# Altium schematic sheet [2]-PHY.SchDoc
size A3; SheetNumber: 2; SheetTotal: 2
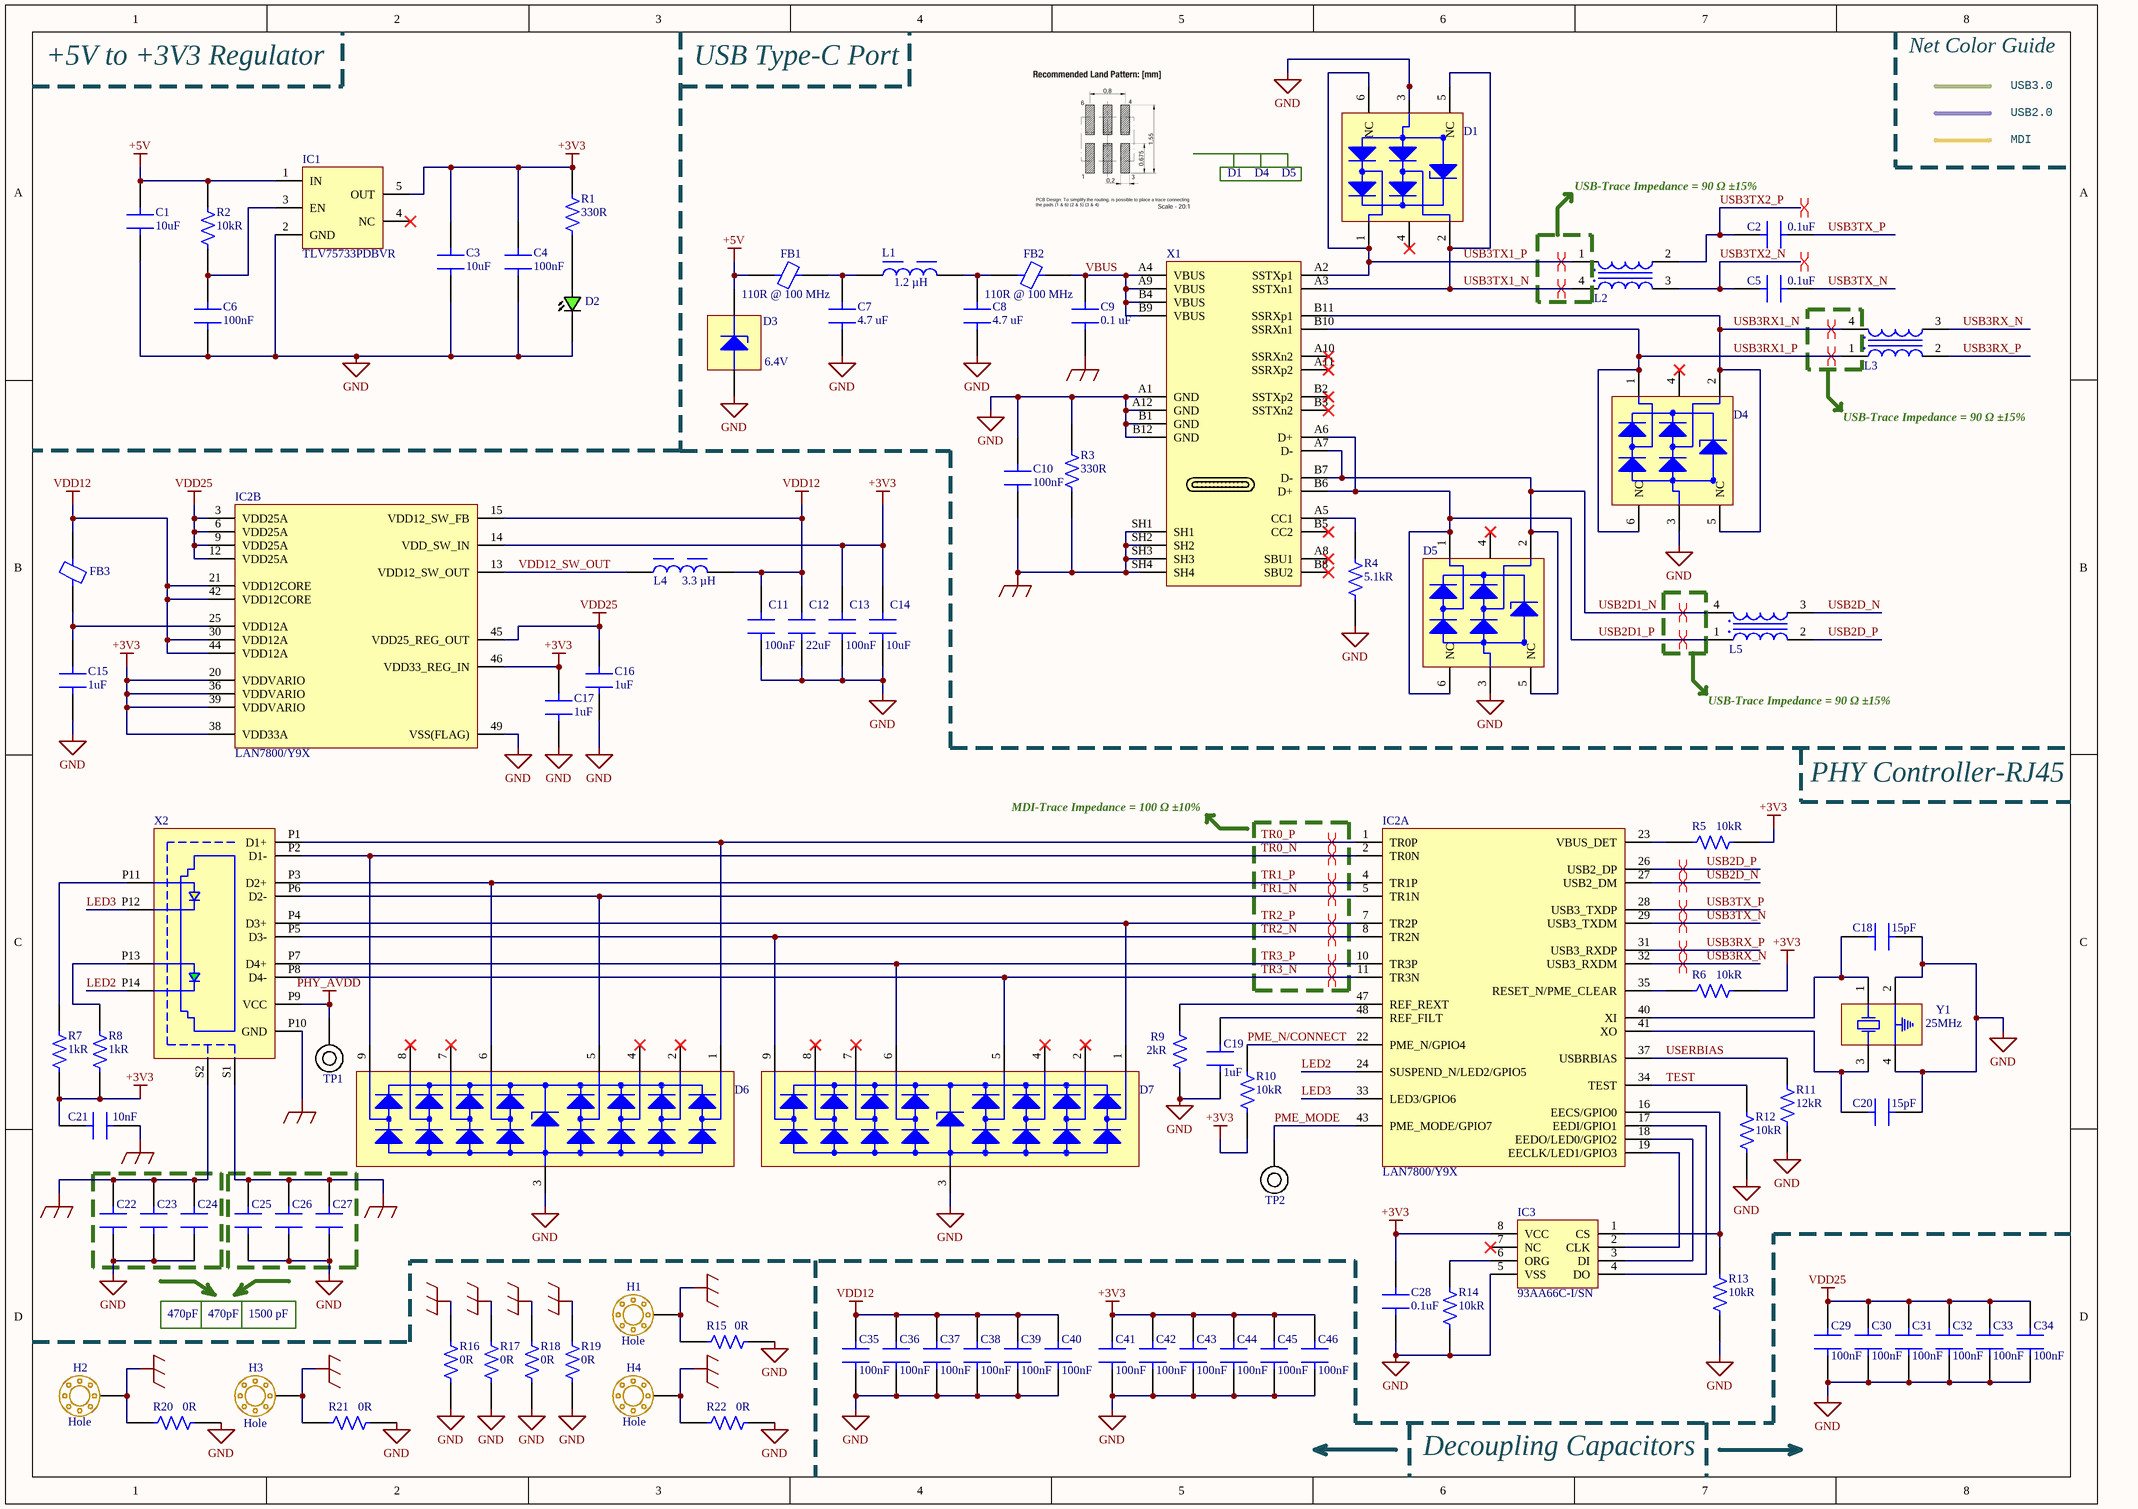
[diagram p0: [2]-PHY.SchDoc]

## Parts
C1  Capacitance: 10uF  [CAP CER 0603 MURATA]  (hidden comment: GRM188R61A106ME69D)
C2  Capacitance: 0.1uF  [CAP CER 0402 (1005 Metric)]  (hidden comment: 885012105018)
C3  Capacitance: 10uF  [CAP CER 0603 MURATA]  (hidden comment: GRM188R61A106ME69D)
C4  Capacitance: 100nF  [CAP CER 0603 (1608 Metric)]  (hidden comment: 885012206071)
C5  Capacitance: 0.1uF  [CAP CER 0402 (1005 Metric)]  (hidden comment: 885012105018)
C6  Capacitance: 100nF  [CAP CER 0603 (1608 Metric)]  (hidden comment: 885012206071)
C7  Capacitance: 4.7 uF  [CAP CER 0805 (2012 Metric)]  (hidden comment: 885012107018)
C8  Capacitance: 4.7 uF  [CAP CER 0805 (2012 Metric)]  (hidden comment: 885012107018)
C9  Capacitance: 0.1 uF  [CAP CER 0805 (2012 Metric)]  (hidden comment: 885012207098)
C10  Capacitance: 100nF  [CAP CER 0603 (1608 Metric)]  (hidden comment: 885012206071)
C11  Capacitance: 100nF  [CAP CER 0603 (1608 Metric)]  (hidden comment: 885012206071)
C12  Capacitance: 22uF  [CAP CER 0805 (2012 Metric)]  (hidden comment: 885012107005)
C13  Capacitance: 100nF  [CAP CER 0603 (1608 Metric)]  (hidden comment: 885012206071)
C14  Capacitance: 10uF  [CAP CER 0603 MURATA]  (hidden comment: GRM188R61A106ME69D)
C15  Capacitance: 1uF  [CAP CER 0603 (1608 Metric)]  (hidden comment: 885012206052)
C16  Capacitance: 1uF  [CAP CER 0603 (1608 Metric)]  (hidden comment: 885012206052)
C17  Capacitance: 1uF  [CAP CER 0603 (1608 Metric)]  (hidden comment: 885012206052)
C18  Capacitance: 15pF  [CAP CER 0402 (1005 Metric)]  (hidden comment: 885012005056)
C19  Capacitance: 1uF  [CAP CER 0603 (1608 Metric)]  (hidden comment: 885012206052)
C20  Capacitance: 15pF  [CAP CER 0402 (1005 Metric)]  (hidden comment: 885012005056)
C21  Capacitance: 10nF  [CAP CER 0603 (1608 Metric)]  (hidden comment: 885012206065)
C22  Capacitance: 470pF  [CAP CER 1206 (3216 Metric)]  (hidden comment: 885342208023)
C23  Capacitance: 470pF  [CAP CER 1206 (3216 Metric)]  (hidden comment: 885342208023)
C24  Capacitance: 1500 pF  [CAP CER 1825 (4564 Metric)]  (hidden comment: HV1825Y152KXMATHV)
C25  885342208023  [CAP CER 1206 (3216 Metric)]  (value not drawn)
C26  885342208023  [CAP CER 1206 (3216 Metric)]  (value not drawn)
C27  HV1825Y152KXMATHV  [CAP CER 1825 (4564 Metric)]  (value not drawn)
C28  Capacitance: 0.1uF  [CAP CER 0603 (1608 Metric)]  (hidden comment: 885012206071)
C29  Capacitance: 100nF  [CAP CER 0603 (1608 Metric)]  (hidden comment: 885012206071)
C30  Capacitance: 100nF  [CAP CER 0603 (1608 Metric)]  (hidden comment: 885012206071)
C31  Capacitance: 100nF  [CAP CER 0603 (1608 Metric)]  (hidden comment: 885012206071)
C32  Capacitance: 100nF  [CAP CER 0603 (1608 Metric)]  (hidden comment: 885012206071)
C33  Capacitance: 100nF  [CAP CER 0603 (1608 Metric)]  (hidden comment: 885012206071)
C34  Capacitance: 100nF  [CAP CER 0603 (1608 Metric)]  (hidden comment: 885012206071)
C35  Capacitance: 100nF  [CAP CER 0603 (1608 Metric)]  (hidden comment: 885012206071)
C36  Capacitance: 100nF  [CAP CER 0603 (1608 Metric)]  (hidden comment: 885012206071)
C37  Capacitance: 100nF  [CAP CER 0603 (1608 Metric)]  (hidden comment: 885012206071)
C38  Capacitance: 100nF  [CAP CER 0603 (1608 Metric)]  (hidden comment: 885012206071)
C39  Capacitance: 100nF  [CAP CER 0603 (1608 Metric)]  (hidden comment: 885012206071)
C40  Capacitance: 100nF  [CAP CER 0603 (1608 Metric)]  (hidden comment: 885012206071)
C41  Capacitance: 100nF  [CAP CER 0603 (1608 Metric)]  (hidden comment: 885012206071)
C42  Capacitance: 100nF  [CAP CER 0603 (1608 Metric)]  (hidden comment: 885012206071)
C43  Capacitance: 100nF  [CAP CER 0603 (1608 Metric)]  (hidden comment: 885012206071)
C44  Capacitance: 100nF  [CAP CER 0603 (1608 Metric)]  (hidden comment: 885012206071)
C45  Capacitance: 100nF  [CAP CER 0603 (1608 Metric)]  (hidden comment: 885012206071)
C46  Capacitance: 100nF  [CAP CER 0603 (1608 Metric)]  (hidden comment: 885012206071)
D1  824012823  [6-XFDFN]  (value not drawn)
D2  150060VS75020  [LED GREEN 0603]  (value not drawn)
D3  Voltage - Breakdown (Min): 6.4V  [2-UDFN]  (hidden comment: ESDA7P60-1U1M)
D4  824012823  [6-XFDFN]  (value not drawn)
D5  824012823  [6-XFDFN]  (value not drawn)
D6  824014885  [DFN3810-9]  (value not drawn)
D7  824014885  [DFN3810-9]  (value not drawn)
FB1  Impedance @ Frequency: 110R @ 100 MHz  [FB 1206 (3216 Metric)]  (hidden comment: 74279221111)
FB2  Impedance @ Frequency: 110R @ 100 MHz  [FB 1206 (3216 Metric)]  (hidden comment: 74279221111)
FB3  742792625  [FB 0603 (1608 Metric)]  (value not drawn)
H1  Hole  [MOUNTING HOLE]
H2  Hole  [MOUNTING HOLE]
H3  Hole  [MOUNTING HOLE]
H4  Hole  [MOUNTING HOLE]
IC1  TLV75733PDBVR  [SOT-23-5]
IC2  LAN7800/Y9X  [48-SQFN (7x7)]  (parts A,B of 2)
IC3  93AA66C-I/SN  [SOIC-8]
L1  Inductance: 1.2 µH  [IND 1212 (3030 Metric)]  (hidden comment: 74438336012)
L2  7442335600  [CMC (1.20mm x 1.00mm), 4 PC Pad]  (value not drawn)
L3  7442335600  [CMC (1.20mm x 1.00mm), 4 PC Pad]  (value not drawn)
L4  Inductance: 3.3 µH  [IND Nonstandard]  (hidden comment: 74404032033)
L5  744232090  [CMC (3.20mm x 1.60mm),4 PC Pad]  (value not drawn)
R1  Resistance: 330R  [RES 0603 SMD]  (hidden comment: RC0603FR-07330RL)
R2  Resistance: 10kR  [RES 0603 SMD]  (hidden comment: RC0603FR-0710KL)
R3  Resistance: 330R  [RES 0603 SMD]  (hidden comment: RC0603FR-07330RL)
R4  Resistance: 5.1kR  [RES 0603 SMD]  (hidden comment: RC0603FR-075K1L)
R5  Resistance: 10kR  [RES 0603 SMD]  (hidden comment: RC0603FR-0710KL)
R6  Resistance: 10kR  [RES 0603 SMD]  (hidden comment: RC0603FR-0710KL)
R7  Resistance: 1kR  [RES 0603 SMD]  (hidden comment: RC0603FR-071KL)
R8  Resistance: 1kR  [RES 0603 SMD]  (hidden comment: RC0603FR-071KL)
R9  Resistance: 2kR  [RES 0603 SMD]  (hidden comment: RC0603FR-072KL)
R10  Resistance: 10kR  [RES 0603 SMD]  (hidden comment: RC0603FR-0710KL)
R11  Resistance: 12kR  [RES 0603 SMD]  (hidden comment: RC0603FR-0712KL)
R12  Resistance: 10kR  [RES 0603 SMD]  (hidden comment: RC0603FR-0710KL)
R13  Resistance: 10kR  [RES 0603 SMD]  (hidden comment: RC0603FR-0710KL)
R14  Resistance: 10kR  [RES 0603 SMD]  (hidden comment: RC0603FR-0710KL)
R15  Resistance: 0R  [RES 0402 SMD]  (hidden comment: RC0402FR-070RL)
R16  Resistance: 0R  [RES 0402 SMD]  (hidden comment: RC0402FR-070RL)
R17  Resistance: 0R  [RES 0402 SMD]  (hidden comment: RC0402FR-070RL)
R18  Resistance: 0R  [RES 0402 SMD]  (hidden comment: RC0402FR-070RL)
R19  Resistance: 0R  [RES 0402 SMD]  (hidden comment: RC0402FR-070RL)
R20  Resistance: 0R  [RES 0402 SMD]  (hidden comment: RC0402FR-070RL)
R21  Resistance: 0R  [RES 0402 SMD]  (hidden comment: RC0402FR-070RL)
R22  Resistance: 0R  [RES 0402 SMD]  (hidden comment: RC0402FR-070RL)
TP1  Test Point  [TEST POINT]  (value not drawn)
TP2  Test Point  [TEST POINT]  (value not drawn)
X1  632723300011  [632723300011]  (value not drawn)
X2  7499111121A  [7499111121A]  (value not drawn)
Y1  Frequency: 25MHz  [TSX-3225 25.0000MF10P-C3]  (hidden comment: TSX-3225 25.0000MF10P-C3)

## Nets
+3V3: C3.2 C4.2 C13.2 C14.2 C17.2 C21.2 C28.2 C41.2 C42.2 C43.2 C44.2 C45.2 C46.2 IC1.5(OUT) IC2.14(VDD_SW_IN) IC2.20(VDDVARIO) IC2.36(VDDVARIO) IC2.38(VDD33A) IC2.39(VDDVARIO) IC2.46(VDD33_REG_IN) IC3.8(VCC) R1.2 R5.2 R6.2 R7.1 R8.1 R10.1
+5V: C1.2 D3.1(I/O) FB1.1 IC1.1(IN) R2.2
GND: C1.1 C3.1 C4.1 C6.1 C7.1 C8.1 C10.2 C11.1 C12.1 C13.1 C14.1 C15.1 C16.1 C17.1 C18.2 C19.1 C20.2 C22.1 C23.1 C24.1 C25.1 C26.1 C27.1 C28.1 C29.1 C30.1 C31.1 C32.1 C33.1 C34.1 C35.1 C36.1 C37.1 C38.1 C39.1 C40.1 C41.1 C42.1 C43.1 C44.1 C45.1 C46.1 D1.3(GND) D2.1(CATHODE) D3.2(GND) D4.3(GND) D5.3(GND) D6.3(GND) D7.3(GND) IC1.2(GND) IC2.49(VSS(FLAG)) IC3.5(VSS) R3.2 R4.1 R9.2 R11.1 R12.1 R13.1 R14.1 R15.1 R16.2 R17.2 R18.2 R19.2 R20.1 R21.1 R22.1 X1.A1(GND) X1.A12(GND) X1.B1(GND) X1.B12(GND) Y1.2(GND) Y1.4(GND)
PHY_AVDD: TP1.TP X2.P9(VCC)
SHIELD: C21.1 C22.2 C23.2 C24.2 C25.2 C26.2 C27.2 H1.H H4.H R15.2 R22.2 X2.P10(GND) X2.S1 X2.S2
SHIELD_USB: C9.1 C10.1 H2.H H3.H R3.1 R16.1 R17.1 R18.1 R19.1 R20.2 R21.2 X1.SH1 X1.SH2 X1.SH3 X1.SH4
VDD12: C11.2 C12.2 C35.2 C36.2 C37.2 C38.2 C39.2 C40.2 FB3.2 IC2.15(VDD12_SW_FB) IC2.21(VDD12CORE) IC2.30(VDD12A) IC2.42(VDD12CORE) IC2.44(VDD12A) L4.2
VDD25: C16.2 C29.2 C30.2 C31.2 C32.2 C33.2 C34.2 IC2.3(VDD25A) IC2.6(VDD25A) IC2.9(VDD25A) IC2.12(VDD25A) IC2.45(VDD25_REG_OUT)
LED2: IC2.24(SUSPEND_N/LED2/GPIO5) X2.P14
LED3: IC2.33(LED3/GPIO6) X2.P12
PME_MODE: IC2.43(PME_MODE/GPIO7) TP2.TP
PME_N/CONNECT: IC2.22(PME_N/GPIO4) R10.2
TEST: IC2.34(TEST) R12.2
TR0_N: D6.9(I/O_8) IC2.2(TR0N) X2.P2(D1-)
TR0_P: D6.1(I/O_1) IC2.1(TR0P) X2.P1(D1+)
TR1_N: D6.5(I/O_4) IC2.5(TR1N) X2.P6(D2-)
TR1_P: D6.6(I/O_5) IC2.4(TR1P) X2.P3(D2+)
TR2_N: D7.9(I/O_8) IC2.8(TR2N) X2.P5(D3-)
TR2_P: D7.1(I/O_1) IC2.7(TR2P) X2.P4(D3+)
TR3_N: D7.5(I/O_4) IC2.11(TR3N) X2.P8(D4-)
TR3_P: D7.6(I/O_5) IC2.10(TR3P) X2.P7(D4+)
USB2D1_N: D5.2(I/O_2) D5.5(NC) L5.4 X1.A7(D-) X1.B7(D-)
USB2D1_P: D5.1(I/O_1) D5.6(NC) L5.1 X1.A6(D+) X1.B6(D+)
USB2D_N: IC2.27(USB2_DM) L5.3
USB2D_P: IC2.26(USB2_DP) L5.2
USB3RX1_N: D4.2(I/O_2) D4.5(NC) L3.4 X1.B11(SSRXp1)
USB3RX1_P: D4.1(I/O_1) D4.6(NC) L3.1 X1.B10(SSRXn1)
USB3RX_N: IC2.32(USB3_RXDM) L3.3
USB3RX_P: IC2.31(USB3_RXDP) L3.2
USB3TX1_N: D1.2(I/O_2) D1.5(NC) L2.4 X1.A3(SSTXn1)
USB3TX1_P: D1.1(I/O_1) D1.6(NC) L2.1 X1.A2(SSTXp1)
USB3TX2_N: C5.1 L2.3
USB3TX2_P: C2.1 L2.2
USB3TX_N: C5.2 IC2.29(USB3_TXDM)
USB3TX_P: C2.2 IC2.28(USB3_TXDP)
USERBIAS: IC2.37(USBRBIAS) R11.2
VBUS: C9.2 FB2.2 X1.A4(VBUS) X1.A9(VBUS) X1.B4(VBUS) X1.B9(VBUS)
VDD12_SW_OUT: IC2.13(VDD12_SW_OUT) L4.1
NetC6_2: C6.2 IC1.3(EN) R2.1
NetC7_2: C7.2 FB1.2 L1.1
NetC8_2: C8.2 FB2.1 L1.2
NetC15_2: C15.2 FB3.1 IC2.25(VDD12A)
NetC18_1: C18.1 IC2.40(XI) Y1.1
NetC19_2: C19.2 IC2.48(REF_FILT)
NetC20_1: C20.1 IC2.41(XO) Y1.3
NetD2_2: D2.2(ANODE) R1.1
NetIC2_16: IC2.16(EECS/GPIO0) IC3.1(CS) R13.2
NetIC2_17: IC2.17(EEDI/GPIO1) IC3.4(DO)
NetIC2_18: IC2.18(EEDO/LED0/GPIO2) IC3.3(DI)
NetIC2_19: IC2.19(EECLK/LED1/GPIO3) IC3.2(CLK)
NetIC2_23: IC2.23(VBUS_DET) R5.1
NetIC2_35: IC2.35(RESET_N/PME_CLEAR) R6.1
NetIC2_47: IC2.47(REF_REXT) R9.1
NetIC3_6: IC3.6(ORG) R14.2
NetR4_2: R4.2 X1.A5(CC1)
NetR7_2: R7.2 X2.P11
NetR8_2: R8.2 X2.P13

Not connected (* = marked no-connect by the designer): D1 4(NC)*; D4 4(NC)*; D5 4(NC)*; D6 2(I/O_2)* 4(I/O_3)* 7(I/O_6)* 8(I/O_7)*; D7 2(I/O_2)* 4(I/O_3)* 7(I/O_6)* 8(I/O_7)*; IC1 4(NC)*; IC3 7(NC)*; X1 A8(SBU1)* A10(SSRXn2)* A11(SSRXp2)* B2(SSTXp2)* B3(SSTXn2)* B5(CC2)* B8(SBU2)*

## Layout directives
differential pair: TR0_N, TR0_P, TR1_N, TR1_P, TR2_N, TR2_P, TR3_N, TR3_P, USB2D1_N, USB2D1_P, USB2D_N, USB2D_P, USB3RX1_N, USB3RX1_P, USB3RX_N, USB3RX_P, USB3TX1_N, USB3TX1_P, USB3TX2_N, USB3TX2_P, USB3TX_N, USB3TX_P

## Notes on the sheet
- +5V to +3V3 Regulator
- USB Type-C Port
- Net Color Guide
- USB3.0
- D1
- D4
- D5
- MDI
- USB2.0
- (near C2) USB-Trace Impedance = 90 Ω ±15%
- USB-Trace Impedance = 90 Ω ±15%
- PHY Controller-RJ45
- MDI-Trace Impedance = 100 Ω ±10%
- Decoupling Capacitors

## Library data of the parts
C1 C3 C14 = CAP CER 10UF 10V: 10 µF ±20% 10V Ceramic Capacitor X5R 0603 (1608 Metric); Manufacturer: Murata Electronics; Designed by: ADAK; Manufacturer Product Number: GRM188R61A106ME69D; Tolerance: ±20%; Voltage-Rated: 10V; Temperature Coefficient: X5R; Operating Temperature: -55°C ~ 85°C; Package/Case: 0603 (1608 Metric)
C2 C5 = CAP CER 0.1UF 25V 0402: 0.1 µF ±20% 25V Ceramic Capacitor X5R 0402 (1005 Metric); Manufacturer: Würth Elektronik; Designed by: ADAK; Manufacturer Product Number: 885012105018; Tolerance: ±20%; Voltage - Rated: 25V; Temperature Coefficient: X5R; Operating Temperature: -55°C ~ 85°C; Package/Case: 0402 (1005 Metric)
C4 C6 C10 C11 C13 C28-C46 = CAP CER 0.1UF 25V: 0.1 µF ±10% 25V Ceramic Capacitor X7R 0603 (1608 Metric); Manufacturer: Würth Elektronik; Designed by: ADAK; Manufacturer Product Number: 885012206071; Tolerance: ±10%; Voltage-Rated: 25V; Temperature Coefficient: X7R; Operating Temperature: -55°C ~ 125°C; Package/Case: 0603 (1608 Metric)
C7 C8 = CAP CER 4.7UF 25V: 4.7 µF ±20% 25V Ceramic Capacitor X5R 0805 (2012 Metric); Manufacturer: Würth Elektronik; Designed by: ADAK; Manufacturer Product Number: 885012107018; Tolerance: ±20%; Voltage Rated: 25V; Temperature Coefficient: X5R; Operating Temperature: -55°C ~ 85°C; Package/Case: 0805 (2012 Metric)
C9 = CAP CER 0.1UF 50V: 0.1 µF ±10% 50V Ceramic Capacitor X7R 0805 (2012 Metric); Manufacturer: Würth Elektronik; Designed by: ADAK; Manufacturer Product Number: 885012207098; Tolerance: ±10%; Voltage - Rated: 50V; Temperature Coefficient: X7R; Operating Temperature: -55°C ~ 125°C; Package/Case: 0805 (2012 Metric)
C12 = CAP CER 22UF 6.3V: 22 µF ±20% 6.3V Ceramic Capacitor X5R 0805 (2012 Metric); Manufacturer: Würth Elektronik; Designed by: ADAK; Manufacturer Product Number: 885012107005; Tolerance: ±20%; Voltage-Rated: 6.3V; Temperature Coefficient: X5R; Operating Temperature: -55°C ~ 85°C; Package/Case: 0805 (2012 Metric)
C15-C17 C19 = CAP CER 1UF 16V 0603: 1 µF ±10% 16V Ceramic Capacitor X7R 0603 (1608 Metric); Manufacturer: Würth Elektronik; Designed by: ADAK; Manufacturer Product Number: 885012206052; Tolerance: ±10%; Voltage-Rated: 16V; Temperature Coefficient: X7R; Operating Temperature: -55°C ~ 125°C; Package/Case: 0603 (1608 Metric)
C18 C20 = CAP CER 15PF 50V: 15 pF ±5% 50V Ceramic Capacitor C0G, NP0 0402 (1005 Metric); Manufacturer: Würth Elektronik; Designed by: ADAK; Manufacturer Product Number: 885012005056; Tolerance: ±5%; Voltage-Rated: 50V; Temperature Coefficient: C0G, NP0; Operating Temperature: -55°C ~ 125°C; Package/Case: 0402 (1005 Metric)
C21 = CAP CER 10000PF 25V: 10000 pF ±10% 25V Ceramic Capacitor X7R 0603 (1608 Metric); Manufacturer: Würth Elektronik; Designed by: ADAK; Manufacturer Product Number: 885012206065; Tolerance: ±10%; Temperature Coefficient: X7R; Voltage-Rated: 25V; Operating Temperature: -55°C ~ 125°C; Package/Case: 0603 (1608 Metric)
C22 C23 = CAP CER 470PF 2000V: 470 pF ±10% 2000V (2kV) Ceramic Capacitor X7R 1206 (3216 Metric); Manufacturer: Würth Elektronik; Designed by: ADAK; Manufacturer Product Number: 885342208023; Tolerance: ±10%; Voltage-Rated: 2000V (2kV); Temperature Coefficient: X7R; Operating Temperature: -55°C ~ 125°C; Feature: High Voltage; Package/Case: 1206 (3216 Metric)
C24 C27 = CAP CER 1500PF 5KV: CAP CER 1500PF 5KV X7R 1825; Manufacturer: Vishay Vitramon; Tolerance: ±10%; Voltage-Rated: 5000V (5kV); Designed by: ADAK; Manufacturer Product Number: HV1825Y152KXMATHV; Temperature Coefficient: X7R; Operating Temperature: -55°C ~ 125°C; Feature: High Voltage; Package/Case: 1825 (4564 Metric)
  C27: Capacitance: 1500 pF
C25 C26 = CAP CER 470PF 2000V: 470 pF ±10% 2000V (2kV) Ceramic Capacitor X7R 1206 (3216 Metric); Manufacturer: Würth Elektronik; Designed by: ADAK; Capacitance: 470pF; Manufacturer Product Number: 885342208023; Tolerance: ±10%; Voltage-Rated: 2000V (2kV); Temperature Coefficient: X7R; Operating Temperature: -55°C ~ 125°C; Feature: High Voltage; Package/Case: 1206 (3216 Metric)
D1 D4 D5 = TVS DIODE 3.3VWM: TVS DIODE 3.3VWM 13VC DFN1210-6; Manufacturer: Würth Elektronik; Voltage - Reverse Standoff (Typ): 3.3V(Max); Voltage - Breakdown (Min): 4.5V; Voltage - Clamping (Max) @ Ipp: 13V(Typ); Current - Peak Pulse (10/1000µs): 3A; Designed by: ADAK; Unidirectional Channels: 2; Manufacturer Product Number: 824012823; Operating Temperature: -55°C ~ 85°C (TA); Package/Case: 6-XFDFN
D2 = LED GREEN 0603: LED GREEN CLEAR 0603 SMD; Manufacturer: Würth Elektronik; Voltage - Forward (Vf) (Typ): 2V; Current - Test: 20mA; Designed by: ADAK; Manufacturer Product Number: 150060VS75020; Color: Green; Mounting Type: Surface Mount; Package Case: 0603 (1608 Metric)
D3 = TVS DIODE 5VWM 11.6VC: TVS DIODE 5VWM 11.6VC 1610; Manufacturer: STMicroelectronics; Type: Zener; Voltage - Reverse Standoff (Typ): 5V; Voltage - Clamping (Max) @ Ipp: 11.6V; Current - Peak Pulse (10/1000µs): 60A (8/20µs); Power - Peak Pulse: 700W; Designed by: ADAK; Manufacturer Product Number: ESDA7P60-1U1M; Operating Temperature: -55°C ~ 150°C (TJ); Package/Case: 2-UDFN
D6 D7 = TVS DIODE 5VWM 10.5VC: TVS DIODE 5VWM 10.5VC DFN3810-9; Manufacturer: Würth Elektronik; Voltage - Reverse Standoff (Typ): 5V (Max); Voltage - Breakdown (Min): 6V; Voltage - Clamping (Max) @ Ipp: 10.5V (Typ); Current - Peak Pulse (10/1000µs): 5A; Designed by: ADAK; Unidirectional Channels: 8; Manufacturer Product Number: 824014885; Operating Temperature: -55°C ~ 85°C (TA); Package/Case: 9-UDFN
FB1 FB2 = FERRITE BEAD 110 OHM: FERRITE BEAD 110 OHM 1206 1LN; Manufacturer: Würth Elektronik; Current Rating (Max): 5.4A; DC Resistance: 15mOhm; Designed by: ADAK; Manufacturer Product Number: 74279221111; Operating Temperature: -55°C ~ 125°C; Package/Case: 1206 (3216 Metric)
FB3 = FERRITE BEAD 120 OHM: FERRITE BEAD 120 OHM 0603 1LN; Manufacturer: Würth Elektronik; Filter Type: Signal Line; Current Rating (Max): 2A; DC Resistance (DCR) (Max): 50mOhm; Designed by: ADAK; Impedance @ Frequency: 120R @ 100 MHz; Manufacturer Product Number: 742792625; Operating Temperature: -55°C ~ 125°C; Package/Case: 0603 (1608 Metric)
H1-H4 = Mounting Hole
IC1 = TLV75733PDBVR: IC REG LINEAR 3.3V 1A SOT23-5; Manufacturer: Texas Instruments; Voltage - Input (Max): 5.5V; Voltage Dropout (Max): 0.475V @ 1A; Designed by: ADAK; Voltage - Output (Min/Fixed): 3.3V; Operating Temperature: -40°C ~ 125°C (TJ); Package/Case: SC-74A, SOT-753; Manufacturer Product Number: TLV75733PDBVR
IC2 = LAN7800/Y9X: IC ETHERNET CTLR USB 48SQFN; Manufacturer: Microchip Technology; Standarts: 10/100/1000 Base-TX PHY; Voltage-Supply: 1.2V, 2.5V, 3.3V; Current-Supply: 1 ~ 4mA; Operatin Temperature: 0°C ~ 70°C; Designed by: ADAK; Protocol: Ethernet; Package/Case: 48-VFQFN Exposed Pad; Manufacturer Product Number: LAN7800/Y9X
IC3 = IC EEPROM 4KBIT: IC EEPROM 4KBIT MICROWIRE 8SOIC; Manufacturer: Microchip Technology; Clock Frequency: 3MHz; Voltage-Supply: 1.8V ~ 5.5V; Designed by: ADAK; Memory Size: 4Kbit; Operating Temperature: -40°C ~ 85°C (TA); Supplier Device Package: 8-SOIC; Manufacturer Product Number: 93AA66C-I/SN
L1 = IND 1.2UH: FIXED IND 1.2UH 3.9A 36 MOHM SMD; Manufacturer: Würth Elektronik; Tolerance: ±20%; Current - Saturation (Isat): 4.75A; DC Resistance (DCR): 36mOhm (Max); Designed by: ADAK; Manufacturer Product Number: 74438336012; Current Rating (Amps): 3.9A; Operating Temperature: -40°C ~ 125°C; Package/Case: 1212 (3030 Metric)
L2 L3 = CMC 60OHM: CMC 600MA 2LN 60OHM SMD AEC-Q200; Manufacturer: Würth Elektronik; Filter Type: Signal Line; Number of Lines: 2; DC Resistance (DCR) (Max): 200mOhm; Impedance @ Frequency: 60 Ohms @ 100 MHz; Voltage Rating - DC: 20V; Designed by: ADAK; Manufacturer Product Number: 7442335600; Current Rating (Max): 600mA; Operating Temperature: -40°C ~ 105°C; Package/Case: Horizontal, 4 PC Pad
L4 = IND 3.3UH: FIXED IND 3.3UH 1.5A 70 MOHM SMD; Manufacturer: Würth Elektronik; Material - Core: Ferrite; Tolerance: ±20%; DC Resistance (DCR): 70mOhm; Designed by: ADAK; Manufacturer Product Number: 74404032033; Current Rating (Amps): 1.5A; Operating Temperature: -40°C ~ 125°C; Package/Case: Nonstandard
L5 = CMC  90OHM: CMC 370MA 2LN 90OHM SMD AEC-Q200; Manufacturer: Würth Elektronik; Filter Type: Signal Line; Number of Lines: 2; Impedance @ Frequency: 90 Ohms @ 100 MHz; DC Resistance (DCR) (Max): 300mOhm; Voltage Rating - DC: 50V; Designed by: ADAK; Manufacturer Product Number: 744232090; Current Rating (Max): 370mA; Operating Temperature: -40°C ~ 125°C; Package/Case: Horizontal, 4 PC Pad
R1 R3 = RES 330 OHM 0603: 330 Ohms ±1% 0.1W, 1/10W Chip Resistor 0603 (1608 Metric) Moisture Resistant Thick Film; Manufacturer: YAGEO; Designed by: ADAK; Manufacturer Part Number: RC0603FR-07330RL; Tolerance: ±1%; Power(Watts): 0.1W, 1/10W; Operating Temperature: -55°C ~ 155°C; Package/Case: 0603 (1608 Metric)
R2 R5 R6 R10 R12-R14 = RES 10K OHM 0603: 10 kOhms ±1% 0.1W, 1/10W Chip Resistor 0603 (1608 Metric) Moisture Resistant Thick Film; Manufacturer: YAGEO; Designed by: ADAK; Manufacturer Product Number: RC0603FR-0710KL; Tolerance: ±1%; Power(Watts): 0.1W, 1/10W; Operating Temperature: -55°C ~ 155°C; Package/Case: 0603 (1608 Metric)
R4 = RES 5K1 OHM 0603: 5.1 kOhms ±1% 0.1W, 1/10W Chip Resistor 0603 (1608 Metric) Moisture Resistant Thick Film; Manufacturer: YAGEO; Designed by: ADAK; Manufacturer Product Number: RC0603FR-075K1L; Tolerance: ±1%; Power(Watts): 0.1W, 1/10W; Operating Temperature: -55°C ~ 155°C; Package/Case: 0603 (1608 Metric)
R7 R8 = RES 1K OHM 0603: 1 kOhms ±1% 0.1W, 1/10W Chip Resistor 0603 (1608 Metric) Moisture Resistant Thick Film; Manufacturer: YAGEO; Designed by: ADAK; Manufacturer Product Number: RC0603FR-071KL; Tolerance: ±1%; Power (Watts): 0.1W, 1/10W; Operating Temperature: -55°C ~ 155°C; Package/Case: 0603 (1608 Metric)
R9 = RES 2K OHM 0603: 2 kOhms ±1% 0.1W, 1/10W Chip Resistor 0603 (1608 Metric) Moisture Resistant Thick Film; Manufacturer: YAGEO; Designed by: ADAK; Manufacturer Product Number: RC0603FR-072KL; Tolerance: ±1%; Power(Watts): 0.1W, 1/10W; Operating Temperature: -55°C ~ 155°C; Package/Case: 0603 (1608 Metric)
R11 = RES 12K OHM 0603: 12 kOhms ±1% 0.1W, 1/10W Chip Resistor 0603 (1608 Metric) Moisture Resistant Thick Film; Manufacturer: YAGEO; Designed by: ADAK; Manufacturer Product Number: RC0603FR-0712KL; Tolerance: ±1%; Power(Watts): 0.1W, 1/10W; Operating Temperature: -55°C ~ 155°C; Package/Case: 0603 (1608 Metric)
R15-R22 = RES 0 OHM 0402: 0 Ohms Jumper Chip Resistor 0402 (1005 Metric) Moisture Resistant Thick Film; Manufacturer: YAGEO; Designed by: ADAK; Manufacturer Product Namer: RC0402FR-070RL; Operating Temperature: -55°C ~ 155°C; Package/Case: 0402 (1005 Metric)
X1 = CONN RCP USB3.1 TYPEC: CONN RCP USB3.1 TYPEC 24P SMD RA; Manufacturer: Würth Elektronik; Specifications: USB 3.2 Gen 2 (USB 3.1 Gen 2, Superspeed + (USB 3.1)); Current Rating (Amps): 5A; Voltage - Rated: 20V; Mating Cycles: 10000; Designed by: ADAK; Connector Type: USB-C (USB TYPE-C); Operating Temperature: -40°C ~ 105°C; Manufacturer Product Number: 632723300011
X2 = CONN JACK RJ45: CONN JACK 1PORT 1000 BASE-T PCB; Manufacturer: Würth Elektronik; Designed by: ADAK; Manufacturer Product Number: 7499111121A; Series: WE-RJ45 LAN; Applications: 10/100/1000 Base-T, AutoMDIX; Mounting Type: Through Hole; Operating Temperature: -40°C ~ 85°C
Y1 = TSX-3225 25.0000MF10P-C3: CRYSTAL 25.0000MHZ 18PF SMD; Manufacturer: EPSON; ESR (Equivalent Series Resistance): 40 Ohms; Designed by: ADAK; Manufacturer Product Number: TSX-3225 25.0000MF10P-C3; Type: MHz Crystal; Load Capacitance: 18pF; Operating Temperature: -20°C ~ 85°C; Package/Case: 4-SMD, No Lead